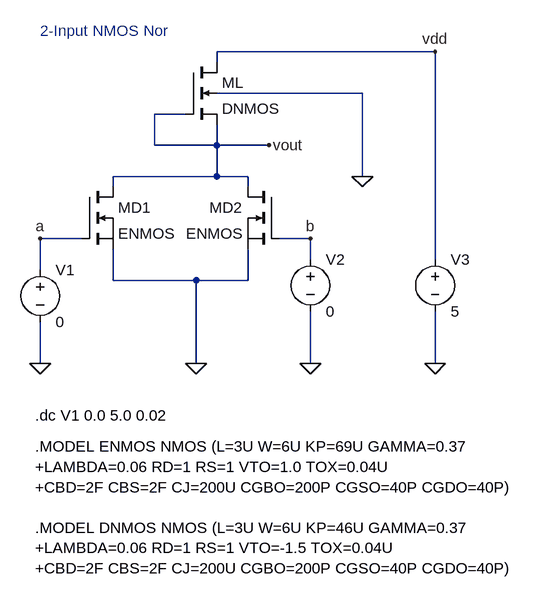
[diagram p0: schematic two_in_nmos_nor_347.asc]
two_in_nmos_nor_347.asc, the LTspice schematic file:
Version 4
SHEET 1 1004 680
WIRE 848 -544 512 -544
WIRE 512 -528 512 -544
WIRE 736 -480 512 -480
WIRE 464 -448 416 -448
WIRE 416 -400 416 -448
WIRE 512 -400 512 -432
WIRE 512 -400 416 -400
WIRE 592 -400 512 -400
WIRE 512 -352 512 -400
WIRE 512 -352 352 -352
WIRE 560 -352 512 -352
WIRE 736 -352 736 -480
WIRE 352 -336 352 -352
WIRE 560 -336 560 -352
WIRE 304 -256 240 -256
WIRE 656 -256 608 -256
WIRE 656 -224 656 -256
WIRE 848 -224 848 -544
WIRE 240 -208 240 -256
WIRE 352 -192 352 -240
WIRE 480 -192 352 -192
WIRE 560 -192 560 -240
WIRE 560 -192 480 -192
WIRE 240 -64 240 -128
WIRE 480 -64 480 -192
WIRE 656 -64 656 -144
WIRE 848 -64 848 -144
FLAG 240 -64 0
FLAG 480 -64 0
FLAG 656 -64 0
FLAG 848 -64 0
FLAG 736 -352 0
FLAG 240 -256 a
FLAG 656 -256 b
FLAG 592 -400 vout
FLAG 848 -544 vdd
SYMBOL voltage 240 -224 R0
SYMATTR InstName V1
SYMATTR Value 0
SYMBOL voltage 656 -240 R0
SYMATTR InstName V2
SYMATTR Value 0
SYMBOL voltage 848 -240 R0
SYMATTR InstName V3
SYMATTR Value 5
SYMBOL nmos 304 -336 R0
SYMATTR InstName MD1
SYMATTR Value ENMOS
SYMBOL nmos 608 -336 M0
SYMATTR InstName MD2
SYMATTR Value ENMOS
SYMBOL nmos4 464 -528 R0
SYMATTR InstName ML
SYMATTR Value DNMOS
TEXT 232 64 Left 2 !.MODEL ENMOS NMOS (L=3U W=6U KP=69U GAMMA=0.37\n+LAMBDA=0.06 RD=1 RS=1 VTO=1.0 TOX=0.04U\n+CBD=2F CBS=2F CJ=200U CGBO=200P CGSO=40P CGDO=40P)\n \n.MODEL DNMOS NMOS (L=3U W=6U KP=46U GAMMA=0.37\n+LAMBDA=0.06 RD=1 RS=1 VTO=-1.5 TOX=0.04U\n+CBD=2F CBS=2F CJ=200U CGBO=200P CGSO=40P CGDO=40P)
TEXT 232 16 Left 2 !.dc V1 0.0 5.0 0.02
TEXT 240 -576 Left 2 ;2-Input NMOS Nor

The netlist it stands for:
* two_in_nmos_nor_347.asc
V1 a 0 0
V2 b 0 0
V3 vdd 0 5
MD1 vout a 0 0 ENMOS
MD2 vout b 0 0 ENMOS
ML vdd vout vout 0 DNMOS
.model NMOS NMOS
.model PMOS PMOS
.lib standard.mos
.MODEL ENMOS NMOS (L=3U W=6U KP=69U GAMMA=0.37
+LAMBDA=0.06 RD=1 RS=1 VTO=1.0 TOX=0.04U
+CBD=2F CBS=2F CJ=200U CGBO=200P CGSO=40P CGDO=40P)
.MODEL DNMOS NMOS (L=3U W=6U KP=46U GAMMA=0.37
+LAMBDA=0.06 RD=1 RS=1 VTO=-1.5 TOX=0.04U
+CBD=2F CBS=2F CJ=200U CGBO=200P CGSO=40P CGDO=40P)
.dc V1 0.0 5.0 0.02
* 2-Input NMOS Nor
.backanno
.end

* Results of the author's LTspice run, read from the files saved beside the schematic
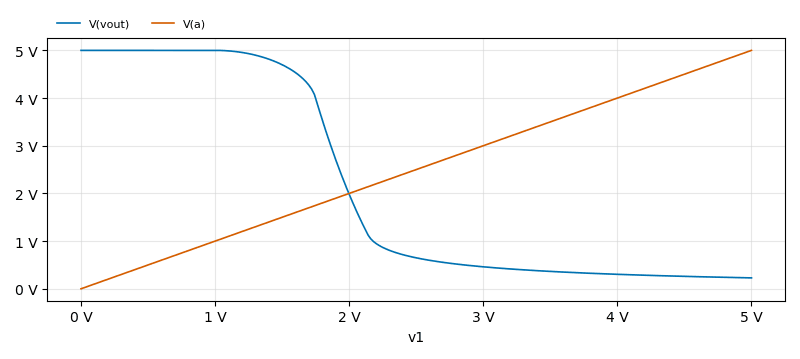
[diagram p1: DC transfer characteristic of two_in_nmos_nor_347.asc, plotted from the saved traces]
* DC transfer characteristic, 1 run:
*   V(vout): 5 V at v1=0 V, 229 mV at v1=5 V, min 229 mV, max 5 V
*   V(a): 0 V at v1=0 V, 5 V at v1=5 V, min 0 V, max 5 V